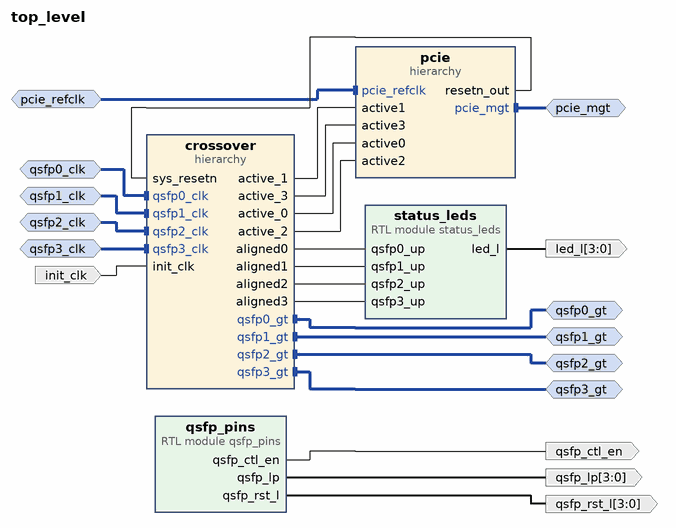
[diagram p0: block diagram of the top level]
# Vivado block design top_level, xcvu9p-flgb2104-3-e, Vivado 2021.1
create_bd_design top_level

create_bd_intf_port -mode Slave -vlnv xilinx.com:interface:diff_clock_rtl:1.0 qsfp0_clk
set_property -dict {CONFIG.FREQ_HZ 322265625} [get_bd_intf_ports qsfp0_clk]
create_bd_intf_port -mode Master -vlnv xilinx.com:interface:gt_rtl:1.0 qsfp0_gt
create_bd_intf_port -mode Master -vlnv xilinx.com:interface:gt_rtl:1.0 qsfp1_gt
create_bd_intf_port -mode Slave -vlnv xilinx.com:interface:diff_clock_rtl:1.0 qsfp1_clk
set_property -dict {CONFIG.FREQ_HZ 322265625} [get_bd_intf_ports qsfp1_clk]
create_bd_intf_port -mode Slave -vlnv xilinx.com:interface:diff_clock_rtl:1.0 pcie_refclk
create_bd_intf_port -mode Master -vlnv xilinx.com:interface:pcie_7x_mgt_rtl:1.0 pcie_mgt
create_bd_intf_port -mode Master -vlnv xilinx.com:interface:gt_rtl:1.0 qsfp2_gt
create_bd_intf_port -mode Slave -vlnv xilinx.com:interface:diff_clock_rtl:1.0 qsfp2_clk
set_property -dict {CONFIG.FREQ_HZ 322265625} [get_bd_intf_ports qsfp2_clk]
create_bd_intf_port -mode Master -vlnv xilinx.com:interface:gt_rtl:1.0 qsfp3_gt
create_bd_intf_port -mode Slave -vlnv xilinx.com:interface:diff_clock_rtl:1.0 qsfp3_clk
set_property -dict {CONFIG.FREQ_HZ 322265625} [get_bd_intf_ports qsfp3_clk]
create_bd_port -dir O -from 3 -to 0 led_l
create_bd_port -dir O -from 3 -to 0 qsfp_rst_l
create_bd_port -dir O -from 3 -to 0 qsfp_lp
create_bd_port -dir I init_clk
create_bd_port -dir O qsfp_ctl_en

create_bd_cell -type hier crossover
create_bd_cell -type hier pcie
create_bd_cell -type module -reference status_leds status_leds
create_bd_cell -type module -reference qsfp_pins qsfp_pins

# ---- hierarchy /crossover ----
current_bd_instance /crossover
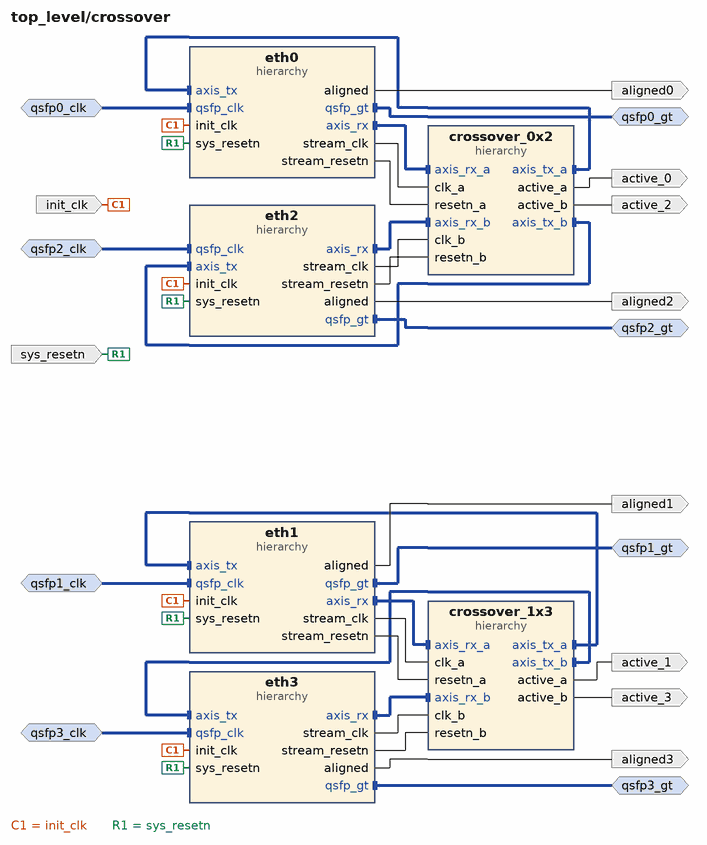
[diagram p1: block diagram inside /crossover]
create_bd_intf_pin -mode Master -vlnv xilinx.com:interface:gt_rtl:1.0 qsfp0_gt
create_bd_intf_pin -mode Slave -vlnv xilinx.com:interface:diff_clock_rtl:1.0 qsfp0_clk
create_bd_intf_pin -mode Master -vlnv xilinx.com:interface:gt_rtl:1.0 qsfp1_gt
create_bd_intf_pin -mode Slave -vlnv xilinx.com:interface:diff_clock_rtl:1.0 qsfp1_clk
create_bd_intf_pin -mode Master -vlnv xilinx.com:interface:gt_rtl:1.0 qsfp2_gt
create_bd_intf_pin -mode Slave -vlnv xilinx.com:interface:diff_clock_rtl:1.0 qsfp2_clk
create_bd_intf_pin -mode Master -vlnv xilinx.com:interface:gt_rtl:1.0 qsfp3_gt
create_bd_intf_pin -mode Slave -vlnv xilinx.com:interface:diff_clock_rtl:1.0 qsfp3_clk
create_bd_pin -dir I init_clk
create_bd_pin -dir I sys_resetn
create_bd_pin -dir O active_0
create_bd_pin -dir O aligned0
create_bd_pin -dir O aligned1
create_bd_pin -dir O active_2
create_bd_pin -dir O aligned2
create_bd_pin -dir O aligned3
create_bd_pin -dir O active_1
create_bd_pin -dir O active_3

create_bd_cell -type hier crossover_0x2
create_bd_cell -type hier eth0
create_bd_cell -type hier eth2
create_bd_cell -type hier eth1
create_bd_cell -type hier eth3
create_bd_cell -type hier crossover_1x3

# ---- hierarchy /crossover/crossover_0x2 ----
current_bd_instance /crossover/crossover_0x2
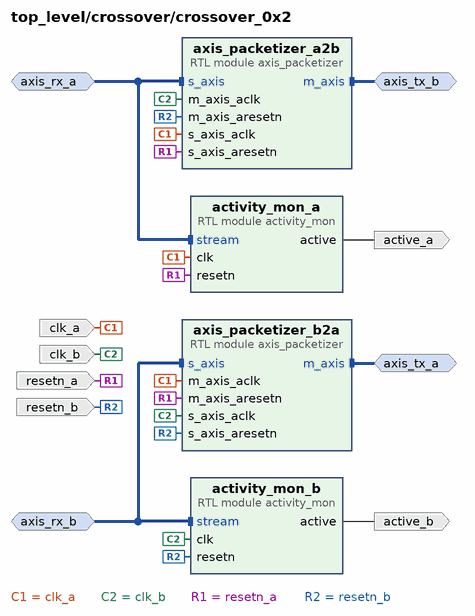
[diagram p2: block diagram inside /crossover/crossover_0x2]
create_bd_intf_pin -mode Slave -vlnv xilinx.com:interface:axis_rtl:1.0 axis_rx_a
create_bd_intf_pin -mode Master -vlnv xilinx.com:interface:axis_rtl:1.0 axis_tx_b
create_bd_intf_pin -mode Master -vlnv xilinx.com:interface:axis_rtl:1.0 axis_tx_a
create_bd_intf_pin -mode Slave -vlnv xilinx.com:interface:axis_rtl:1.0 axis_rx_b
create_bd_pin -dir I clk_a
create_bd_pin -dir I resetn_a
create_bd_pin -dir I clk_b
create_bd_pin -dir I resetn_b
create_bd_pin -dir O active_a
create_bd_pin -dir O active_b

create_bd_cell -type module -reference activity_mon activity_mon_a
create_bd_cell -type module -reference activity_mon activity_mon_b
create_bd_cell -type module -reference axis_packetizer axis_packetizer_a2b
create_bd_cell -type module -reference axis_packetizer axis_packetizer_b2a

# ---- hierarchy /crossover/eth0 ----
current_bd_instance /crossover/eth0
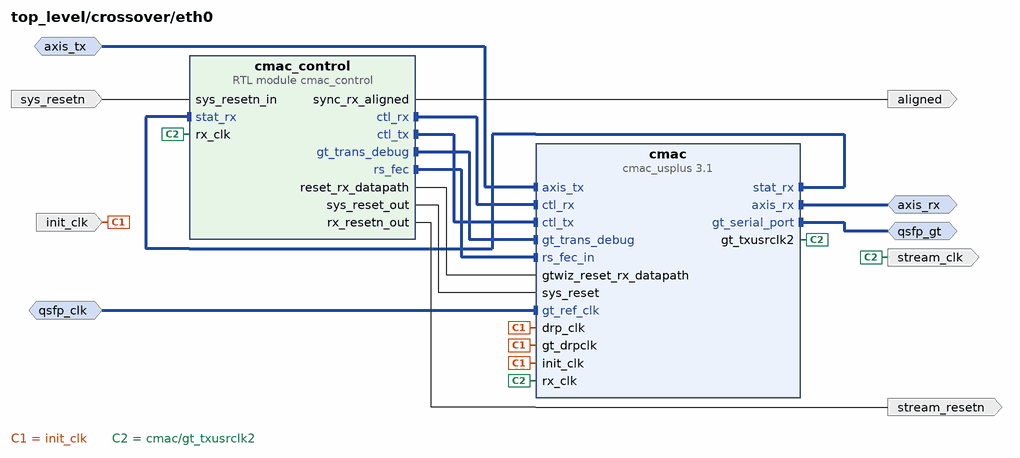
[diagram p3: block diagram inside /crossover/eth0]
create_bd_intf_pin -mode Master -vlnv xilinx.com:interface:gt_rtl:1.0 qsfp_gt
create_bd_intf_pin -mode Slave -vlnv xilinx.com:interface:diff_clock_rtl:1.0 qsfp_clk
create_bd_intf_pin -mode Slave -vlnv xilinx.com:interface:axis_rtl:1.0 axis_tx
create_bd_intf_pin -mode Master -vlnv xilinx.com:interface:axis_rtl:1.0 axis_rx
create_bd_pin -dir I -type rst sys_resetn
create_bd_pin -dir O -type clk stream_clk
create_bd_pin -dir O -type rst stream_resetn
create_bd_pin -dir O aligned
create_bd_pin -dir I init_clk

create_bd_cell -type ip -vlnv xilinx.com:ip:cmac_usplus:3.1 cmac
set_property -dict [list \
  CONFIG.ADD_GT_CNRL_STS_PORTS 1 \
  CONFIG.CMAC_CAUI4_MODE 1 \
  CONFIG.CMAC_CORE_SELECT CMACE4_X0Y1 \
  CONFIG.GT_DRP_CLK 50 \
  CONFIG.GT_GROUP_SELECT {X0Y4~X0Y7} \
  CONFIG.GT_REF_CLK_FREQ 322.265625 \
  CONFIG.INCLUDE_RS_FEC 1 \
  CONFIG.NUM_LANES 4x25 \
  CONFIG.RX_FLOW_CONTROL 0 \
  CONFIG.RX_GT_BUFFER 1 \
  CONFIG.TX_FLOW_CONTROL 0 \
  CONFIG.USER_INTERFACE AXIS \
] [get_bd_cells cmac]
create_bd_cell -type module -reference cmac_control cmac_control
set_property -dict {CONFIG.USE_SYS_RESET_OUT 1} [get_bd_cells cmac_control]

# ---- hierarchy /crossover/eth2 ----
current_bd_instance /crossover/eth2
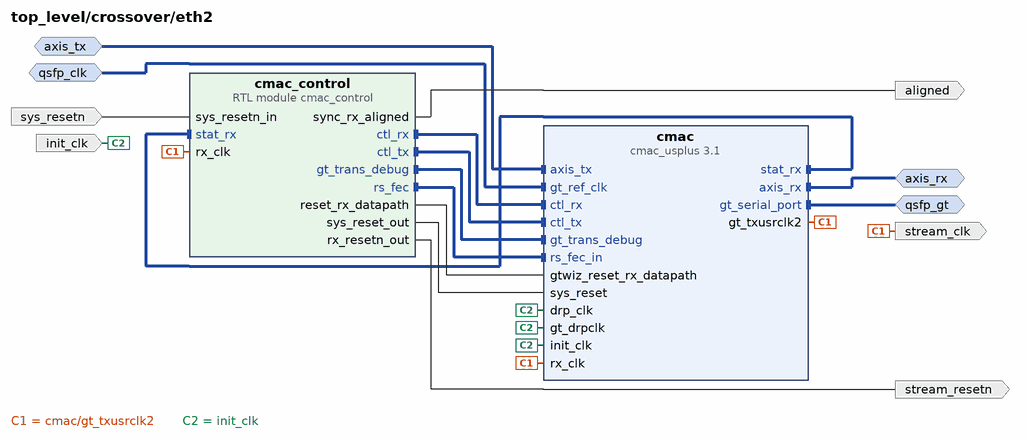
[diagram p4: block diagram inside /crossover/eth2]
create_bd_intf_pin -mode Master -vlnv xilinx.com:interface:gt_rtl:1.0 qsfp_gt
create_bd_intf_pin -mode Slave -vlnv xilinx.com:interface:axis_rtl:1.0 axis_tx
create_bd_intf_pin -mode Master -vlnv xilinx.com:interface:axis_rtl:1.0 axis_rx
create_bd_intf_pin -mode Slave -vlnv xilinx.com:interface:diff_clock_rtl:1.0 qsfp_clk
create_bd_pin -dir I -type rst sys_resetn
create_bd_pin -dir O -type clk stream_clk
create_bd_pin -dir O -type rst stream_resetn
create_bd_pin -dir O aligned
create_bd_pin -dir I init_clk

create_bd_cell -type ip -vlnv xilinx.com:ip:cmac_usplus:3.1 cmac
set_property -dict [list \
  CONFIG.ADD_GT_CNRL_STS_PORTS 1 \
  CONFIG.CMAC_CAUI4_MODE 1 \
  CONFIG.CMAC_CORE_SELECT CMACE4_X0Y4 \
  CONFIG.GT_DRP_CLK 50 \
  CONFIG.GT_GROUP_SELECT {X0Y24~X0Y27} \
  CONFIG.GT_REF_CLK_FREQ 322.265625 \
  CONFIG.INCLUDE_RS_FEC 1 \
  CONFIG.NUM_LANES 4x25 \
  CONFIG.RX_FLOW_CONTROL 0 \
  CONFIG.RX_GT_BUFFER 1 \
  CONFIG.TX_FLOW_CONTROL 0 \
  CONFIG.USER_INTERFACE AXIS \
] [get_bd_cells cmac]
create_bd_cell -type module -reference cmac_control cmac_control
set_property -dict {CONFIG.USE_SYS_RESET_OUT 1} [get_bd_cells cmac_control]

# ---- hierarchy /crossover/eth1 ----
current_bd_instance /crossover/eth1
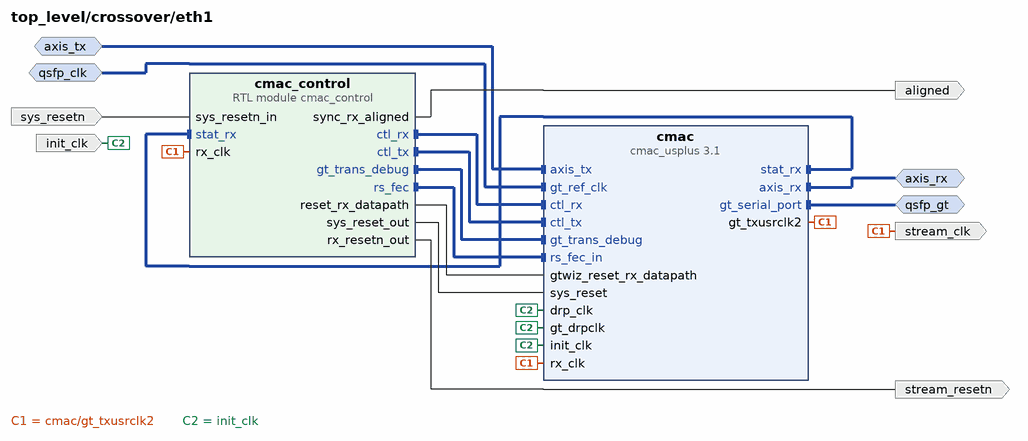
[diagram p5: block diagram inside /crossover/eth1]
create_bd_intf_pin -mode Master -vlnv xilinx.com:interface:gt_rtl:1.0 qsfp_gt
create_bd_intf_pin -mode Slave -vlnv xilinx.com:interface:axis_rtl:1.0 axis_tx
create_bd_intf_pin -mode Master -vlnv xilinx.com:interface:axis_rtl:1.0 axis_rx
create_bd_intf_pin -mode Slave -vlnv xilinx.com:interface:diff_clock_rtl:1.0 qsfp_clk
create_bd_pin -dir I -type rst sys_resetn
create_bd_pin -dir O -type clk stream_clk
create_bd_pin -dir O -type rst stream_resetn
create_bd_pin -dir O aligned
create_bd_pin -dir I init_clk

create_bd_cell -type ip -vlnv xilinx.com:ip:cmac_usplus:3.1 cmac
set_property -dict [list \
  CONFIG.ADD_GT_CNRL_STS_PORTS 1 \
  CONFIG.CMAC_CAUI4_MODE 1 \
  CONFIG.CMAC_CORE_SELECT CMACE4_X0Y2 \
  CONFIG.GT_DRP_CLK 50 \
  CONFIG.GT_GROUP_SELECT {X0Y12~X0Y15} \
  CONFIG.GT_REF_CLK_FREQ 322.265625 \
  CONFIG.INCLUDE_RS_FEC 1 \
  CONFIG.NUM_LANES 4x25 \
  CONFIG.RX_FLOW_CONTROL 0 \
  CONFIG.RX_GT_BUFFER 1 \
  CONFIG.TX_FLOW_CONTROL 0 \
  CONFIG.USER_INTERFACE AXIS \
] [get_bd_cells cmac]
create_bd_cell -type module -reference cmac_control cmac_control
set_property -dict {CONFIG.USE_SYS_RESET_OUT 1} [get_bd_cells cmac_control]

# ---- hierarchy /crossover/eth3 ----
current_bd_instance /crossover/eth3
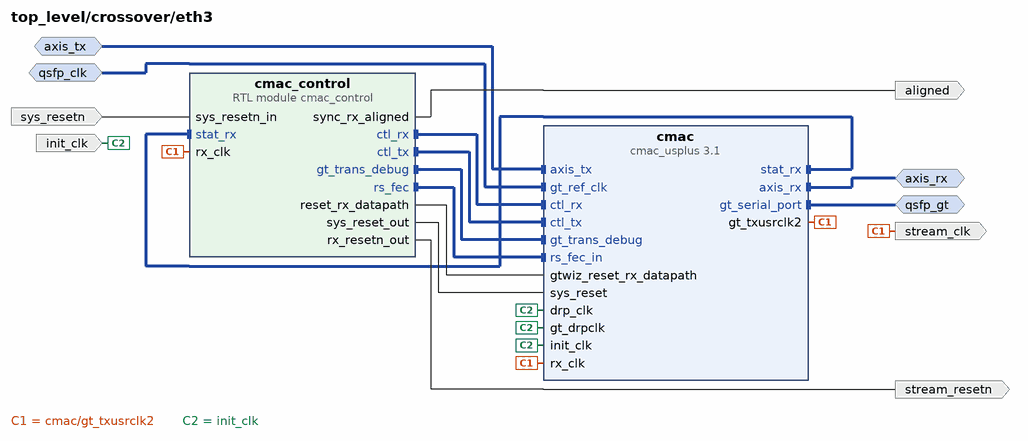
[diagram p6: block diagram inside /crossover/eth3]
create_bd_intf_pin -mode Master -vlnv xilinx.com:interface:gt_rtl:1.0 qsfp_gt
create_bd_intf_pin -mode Slave -vlnv xilinx.com:interface:axis_rtl:1.0 axis_tx
create_bd_intf_pin -mode Master -vlnv xilinx.com:interface:axis_rtl:1.0 axis_rx
create_bd_intf_pin -mode Slave -vlnv xilinx.com:interface:diff_clock_rtl:1.0 qsfp_clk
create_bd_pin -dir I -type rst sys_resetn
create_bd_pin -dir O -type clk stream_clk
create_bd_pin -dir O -type rst stream_resetn
create_bd_pin -dir O aligned
create_bd_pin -dir I init_clk

create_bd_cell -type ip -vlnv xilinx.com:ip:cmac_usplus:3.1 cmac
set_property -dict [list \
  CONFIG.ADD_GT_CNRL_STS_PORTS 1 \
  CONFIG.CMAC_CAUI4_MODE 1 \
  CONFIG.CMAC_CORE_SELECT CMACE4_X0Y5 \
  CONFIG.GT_DRP_CLK 50 \
  CONFIG.GT_GROUP_SELECT {X0Y32~X0Y35} \
  CONFIG.GT_REF_CLK_FREQ 322.265625 \
  CONFIG.INCLUDE_RS_FEC 1 \
  CONFIG.NUM_LANES 4x25 \
  CONFIG.RX_FLOW_CONTROL 0 \
  CONFIG.RX_GT_BUFFER 1 \
  CONFIG.TX_FLOW_CONTROL 0 \
  CONFIG.USER_INTERFACE AXIS \
] [get_bd_cells cmac]
create_bd_cell -type module -reference cmac_control cmac_control
set_property -dict {CONFIG.USE_SYS_RESET_OUT 1} [get_bd_cells cmac_control]

# ---- hierarchy /crossover/crossover_1x3 ----
current_bd_instance /crossover/crossover_1x3
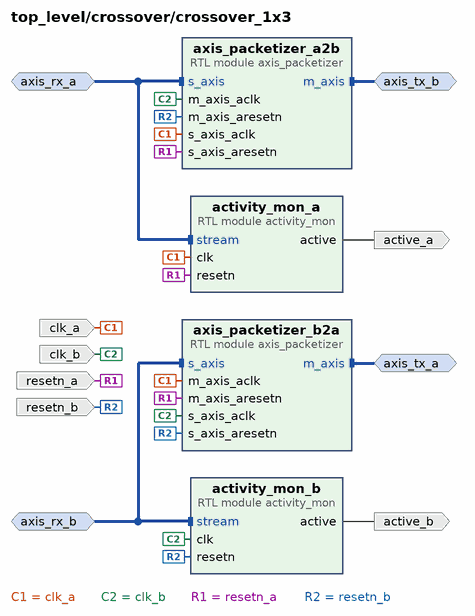
[diagram p7: block diagram inside /crossover/crossover_1x3]
create_bd_intf_pin -mode Slave -vlnv xilinx.com:interface:axis_rtl:1.0 axis_rx_a
create_bd_intf_pin -mode Master -vlnv xilinx.com:interface:axis_rtl:1.0 axis_tx_b
create_bd_intf_pin -mode Master -vlnv xilinx.com:interface:axis_rtl:1.0 axis_tx_a
create_bd_intf_pin -mode Slave -vlnv xilinx.com:interface:axis_rtl:1.0 axis_rx_b
create_bd_pin -dir I clk_a
create_bd_pin -dir I resetn_a
create_bd_pin -dir I clk_b
create_bd_pin -dir I resetn_b
create_bd_pin -dir O active_a
create_bd_pin -dir O active_b

create_bd_cell -type module -reference activity_mon activity_mon_a
create_bd_cell -type module -reference activity_mon activity_mon_b
create_bd_cell -type module -reference axis_packetizer axis_packetizer_a2b
create_bd_cell -type module -reference axis_packetizer axis_packetizer_b2a

# ---- hierarchy /pcie ----
current_bd_instance /pcie
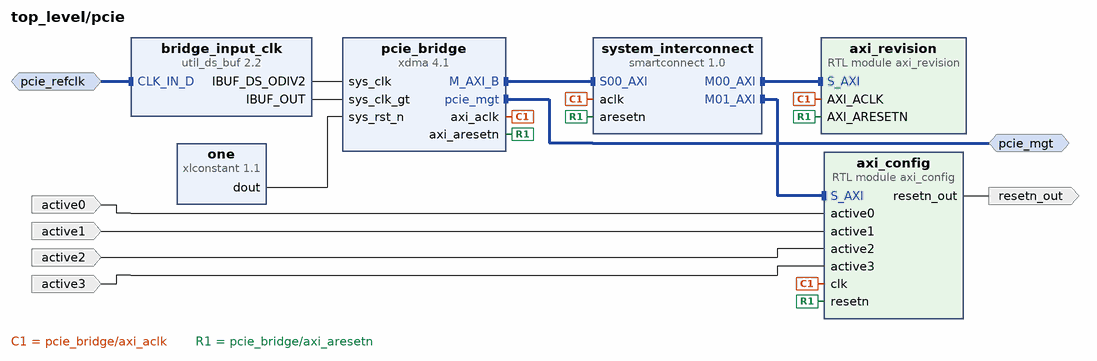
[diagram p8: block diagram inside /pcie]
create_bd_intf_pin -mode Master -vlnv xilinx.com:interface:pcie_7x_mgt_rtl:1.0 pcie_mgt
create_bd_intf_pin -mode Slave -vlnv xilinx.com:interface:diff_clock_rtl:1.0 pcie_refclk
create_bd_pin -dir O resetn_out
create_bd_pin -dir I active0
create_bd_pin -dir I active1
create_bd_pin -dir I active2
create_bd_pin -dir I active3

create_bd_cell -type module -reference axi_revision axi_revision
create_bd_cell -type ip -vlnv xilinx.com:ip:smartconnect:1.0 system_interconnect
set_property -dict {CONFIG.NUM_MI 2 CONFIG.NUM_SI 1} [get_bd_cells system_interconnect]
create_bd_cell -type ip -vlnv xilinx.com:ip:util_ds_buf:2.2 bridge_input_clk
set_property -dict {CONFIG.C_BUF_TYPE IBUFDSGTE} [get_bd_cells bridge_input_clk]
create_bd_cell -type ip -vlnv xilinx.com:ip:xdma:4.1 pcie_bridge
set_property -dict [list \
  CONFIG.PF0_DEVICE_ID_mqdma 903F \
  CONFIG.PF0_SRIOV_VF_DEVICE_ID A03F \
  CONFIG.PF2_DEVICE_ID_mqdma 923F \
  CONFIG.PF3_DEVICE_ID_mqdma 933F \
  CONFIG.axi_addr_width 64 \
  CONFIG.axi_data_width 512_bit \
  CONFIG.axisten_freq 250 \
  CONFIG.bridge_burst true \
  CONFIG.en_axi_master_if true \
  CONFIG.en_axi_slave_if false \
  CONFIG.functional_mode AXI_Bridge \
  CONFIG.mode_selection Advanced \
  CONFIG.pcie_blk_locn X1Y2 \
  CONFIG.pf0_bar0_scale Megabytes \
  CONFIG.pf0_bar0_size 1 \
  CONFIG.pf0_bar1_enabled true \
  CONFIG.pf0_bar1_scale Megabytes \
  CONFIG.pf0_bar1_size 1 \
  CONFIG.pf0_device_id 903F \
  CONFIG.pl_link_cap_max_link_speed 8.0_GT/s \
  CONFIG.pl_link_cap_max_link_width X16 \
  CONFIG.plltype QPLL1 \
] [get_bd_cells pcie_bridge]
create_bd_cell -type ip -vlnv xilinx.com:ip:xlconstant:1.1 one
create_bd_cell -type module -reference axi_config axi_config

# ---- connections ----

current_bd_instance /crossover
connect_bd_intf_net [get_bd_intf_pins crossover_0x2/axis_rx_a] [get_bd_intf_pins eth0/axis_rx]
connect_bd_intf_net [get_bd_intf_pins crossover_0x2/axis_rx_b] [get_bd_intf_pins eth2/axis_rx]
connect_bd_intf_net [get_bd_intf_pins eth1/axis_tx] [get_bd_intf_pins crossover_1x3/axis_tx_a]
connect_bd_intf_net [get_bd_intf_pins eth3/axis_tx] [get_bd_intf_pins crossover_1x3/axis_tx_b]
connect_bd_intf_net [get_bd_intf_pins crossover_0x2/axis_tx_a] [get_bd_intf_pins eth0/axis_tx]
connect_bd_intf_net [get_bd_intf_pins crossover_0x2/axis_tx_b] [get_bd_intf_pins eth2/axis_tx]
connect_bd_intf_net [get_bd_intf_pins eth1/axis_rx] [get_bd_intf_pins crossover_1x3/axis_rx_a]
connect_bd_intf_net [get_bd_intf_pins eth3/axis_rx] [get_bd_intf_pins crossover_1x3/axis_rx_b]
connect_bd_intf_net [get_bd_intf_pins qsfp0_gt] [get_bd_intf_pins eth0/qsfp_gt]
connect_bd_intf_net [get_bd_intf_pins qsfp2_gt] [get_bd_intf_pins eth2/qsfp_gt]
connect_bd_intf_net [get_bd_intf_pins qsfp1_gt] [get_bd_intf_pins eth1/qsfp_gt]
connect_bd_intf_net [get_bd_intf_pins qsfp3_gt] [get_bd_intf_pins eth3/qsfp_gt]
connect_bd_intf_net [get_bd_intf_pins qsfp0_clk] [get_bd_intf_pins eth0/qsfp_clk]
connect_bd_intf_net [get_bd_intf_pins qsfp1_clk] [get_bd_intf_pins eth1/qsfp_clk]
connect_bd_intf_net [get_bd_intf_pins qsfp2_clk] [get_bd_intf_pins eth2/qsfp_clk]
connect_bd_intf_net [get_bd_intf_pins qsfp3_clk] [get_bd_intf_pins eth3/qsfp_clk]
connect_bd_net -net clk_a_1 [get_bd_pins eth0/stream_clk] [get_bd_pins crossover_0x2/clk_a]
connect_bd_net -net clk_b_1 [get_bd_pins eth2/stream_clk] [get_bd_pins crossover_0x2/clk_b]
connect_bd_net [get_bd_pins crossover_0x2/active_a] [get_bd_pins active_0]
connect_bd_net [get_bd_pins crossover_0x2/active_b] [get_bd_pins active_2]
connect_bd_net [get_bd_pins crossover_1x3/active_a] [get_bd_pins active_1]
connect_bd_net [get_bd_pins crossover_1x3/active_b] [get_bd_pins active_3]
connect_bd_net [get_bd_pins eth1/stream_clk] [get_bd_pins crossover_1x3/clk_a]
connect_bd_net [get_bd_pins eth1/stream_resetn] [get_bd_pins crossover_1x3/resetn_a]
connect_bd_net [get_bd_pins eth3/stream_clk] [get_bd_pins crossover_1x3/clk_b]
connect_bd_net [get_bd_pins eth3/stream_resetn] [get_bd_pins crossover_1x3/resetn_b]
connect_bd_net -net eth_aligned [get_bd_pins eth0/aligned] [get_bd_pins aligned0]
connect_bd_net -net eth_aligned1 [get_bd_pins eth2/aligned] [get_bd_pins aligned2]
connect_bd_net -net eth_aligned2 [get_bd_pins eth1/aligned] [get_bd_pins aligned1]
connect_bd_net -net eth_aligned3 [get_bd_pins eth3/aligned] [get_bd_pins aligned3]
connect_bd_net -net init_clk_0_1 [get_bd_pins init_clk] \
  [get_bd_pins eth0/init_clk] [get_bd_pins eth2/init_clk] [get_bd_pins eth1/init_clk] [get_bd_pins eth3/init_clk]
connect_bd_net -net resetn_a_1 [get_bd_pins eth0/stream_resetn] [get_bd_pins crossover_0x2/resetn_a]
connect_bd_net -net resetn_b_1 [get_bd_pins eth2/stream_resetn] [get_bd_pins crossover_0x2/resetn_b]
connect_bd_net -net source_200Mhz_resetn [get_bd_pins sys_resetn] \
  [get_bd_pins eth0/sys_resetn] [get_bd_pins eth2/sys_resetn] [get_bd_pins eth1/sys_resetn] [get_bd_pins eth3/sys_resetn]

current_bd_instance /crossover/crossover_0x2
connect_bd_intf_net [get_bd_intf_pins axis_tx_b] [get_bd_intf_pins axis_packetizer_a2b/m_axis]
connect_bd_intf_net [get_bd_intf_pins axis_tx_a] [get_bd_intf_pins axis_packetizer_b2a/m_axis]
connect_bd_intf_net [get_bd_intf_pins axis_rx_a] [get_bd_intf_pins axis_packetizer_a2b/s_axis]
connect_bd_intf_net [get_bd_intf_pins axis_rx_a] [get_bd_intf_pins activity_mon_a/stream]
connect_bd_intf_net [get_bd_intf_pins axis_rx_b] [get_bd_intf_pins axis_packetizer_b2a/s_axis]
connect_bd_intf_net [get_bd_intf_pins axis_rx_b] [get_bd_intf_pins activity_mon_b/stream]
connect_bd_net [get_bd_pins activity_mon_a/active] [get_bd_pins active_a]
connect_bd_net [get_bd_pins activity_mon_b/active] [get_bd_pins active_b]
connect_bd_net [get_bd_pins clk_a] \
  [get_bd_pins activity_mon_a/clk] [get_bd_pins axis_packetizer_a2b/s_axis_aclk] \
  [get_bd_pins axis_packetizer_b2a/m_axis_aclk]
connect_bd_net [get_bd_pins clk_b] \
  [get_bd_pins activity_mon_b/clk] [get_bd_pins axis_packetizer_a2b/m_axis_aclk] \
  [get_bd_pins axis_packetizer_b2a/s_axis_aclk]
connect_bd_net [get_bd_pins resetn_a] \
  [get_bd_pins activity_mon_a/resetn] [get_bd_pins axis_packetizer_a2b/s_axis_aresetn] \
  [get_bd_pins axis_packetizer_b2a/m_axis_aresetn]
connect_bd_net [get_bd_pins resetn_b] \
  [get_bd_pins activity_mon_b/resetn] [get_bd_pins axis_packetizer_a2b/m_axis_aresetn] \
  [get_bd_pins axis_packetizer_b2a/s_axis_aresetn]

current_bd_instance /crossover/eth0
connect_bd_intf_net [get_bd_intf_pins axis_tx] [get_bd_intf_pins cmac/axis_tx]
connect_bd_intf_net [get_bd_intf_pins axis_rx] [get_bd_intf_pins cmac/axis_rx]
connect_bd_intf_net [get_bd_intf_pins cmac_control/ctl_rx] [get_bd_intf_pins cmac/ctl_rx]
connect_bd_intf_net [get_bd_intf_pins cmac_control/ctl_tx] [get_bd_intf_pins cmac/ctl_tx]
connect_bd_intf_net [get_bd_intf_pins cmac_control/gt_trans_debug] [get_bd_intf_pins cmac/gt_trans_debug]
connect_bd_intf_net [get_bd_intf_pins cmac_control/rs_fec] [get_bd_intf_pins cmac/rs_fec_in]
connect_bd_intf_net [get_bd_intf_pins cmac_control/stat_rx] [get_bd_intf_pins cmac/stat_rx]
connect_bd_intf_net [get_bd_intf_pins qsfp_gt] [get_bd_intf_pins cmac/gt_serial_port]
connect_bd_intf_net [get_bd_intf_pins qsfp_clk] [get_bd_intf_pins cmac/gt_ref_clk]
connect_bd_net -net clk_0_1 [get_bd_pins init_clk] [get_bd_pins cmac/gt_drpclk] [get_bd_pins cmac/init_clk] [get_bd_pins cmac/drp_clk]
connect_bd_net -net cmac_control_0_reset_rx_datapath [get_bd_pins cmac_control/reset_rx_datapath] [get_bd_pins cmac/gtwiz_reset_rx_datapath]
connect_bd_net -net cmac_control_0_rx_resetn_out [get_bd_pins cmac_control/rx_resetn_out] [get_bd_pins stream_resetn]
connect_bd_net -net cmac_control_0_sync_rx_aligned [get_bd_pins cmac_control/sync_rx_aligned] [get_bd_pins aligned]
connect_bd_net [get_bd_pins cmac_control/sys_reset_out] [get_bd_pins cmac/sys_reset]
connect_bd_net -net cmac_gt_rxusrclk2 [get_bd_pins cmac/gt_txusrclk2] \
  [get_bd_pins stream_clk] [get_bd_pins cmac/rx_clk] [get_bd_pins cmac_control/rx_clk]
connect_bd_net [get_bd_pins sys_resetn] [get_bd_pins cmac_control/sys_resetn_in]

current_bd_instance /crossover/eth2
connect_bd_intf_net [get_bd_intf_pins axis_tx] [get_bd_intf_pins cmac/axis_tx]
connect_bd_intf_net [get_bd_intf_pins qsfp_clk] [get_bd_intf_pins cmac/gt_ref_clk]
connect_bd_intf_net [get_bd_intf_pins axis_rx] [get_bd_intf_pins cmac/axis_rx]
connect_bd_intf_net [get_bd_intf_pins cmac_control/ctl_rx] [get_bd_intf_pins cmac/ctl_rx]
connect_bd_intf_net [get_bd_intf_pins cmac_control/ctl_tx] [get_bd_intf_pins cmac/ctl_tx]
connect_bd_intf_net [get_bd_intf_pins cmac_control/gt_trans_debug] [get_bd_intf_pins cmac/gt_trans_debug]
connect_bd_intf_net [get_bd_intf_pins cmac_control/rs_fec] [get_bd_intf_pins cmac/rs_fec_in]
connect_bd_intf_net [get_bd_intf_pins cmac_control/stat_rx] [get_bd_intf_pins cmac/stat_rx]
connect_bd_intf_net [get_bd_intf_pins qsfp_gt] [get_bd_intf_pins cmac/gt_serial_port]
connect_bd_net -net cmac_control_0_reset_rx_datapath [get_bd_pins cmac_control/reset_rx_datapath] [get_bd_pins cmac/gtwiz_reset_rx_datapath]
connect_bd_net -net cmac_control_0_rx_resetn_out [get_bd_pins cmac_control/rx_resetn_out] [get_bd_pins stream_resetn]
connect_bd_net -net cmac_control_0_sync_rx_aligned [get_bd_pins cmac_control/sync_rx_aligned] [get_bd_pins aligned]
connect_bd_net [get_bd_pins cmac_control/sys_reset_out] [get_bd_pins cmac/sys_reset]
connect_bd_net -net cmac_gt_rxusrclk2 [get_bd_pins cmac/gt_txusrclk2] \
  [get_bd_pins stream_clk] [get_bd_pins cmac/rx_clk] [get_bd_pins cmac_control/rx_clk]
connect_bd_net -net init_clk_divider_init_clk [get_bd_pins init_clk] \
  [get_bd_pins cmac/gt_drpclk] [get_bd_pins cmac/init_clk] [get_bd_pins cmac/drp_clk]
connect_bd_net [get_bd_pins sys_resetn] [get_bd_pins cmac_control/sys_resetn_in]

current_bd_instance /crossover/eth1
connect_bd_intf_net [get_bd_intf_pins axis_tx] [get_bd_intf_pins cmac/axis_tx]
connect_bd_intf_net [get_bd_intf_pins qsfp_clk] [get_bd_intf_pins cmac/gt_ref_clk]
connect_bd_intf_net [get_bd_intf_pins axis_rx] [get_bd_intf_pins cmac/axis_rx]
connect_bd_intf_net [get_bd_intf_pins cmac_control/ctl_rx] [get_bd_intf_pins cmac/ctl_rx]
connect_bd_intf_net [get_bd_intf_pins cmac_control/ctl_tx] [get_bd_intf_pins cmac/ctl_tx]
connect_bd_intf_net [get_bd_intf_pins cmac_control/gt_trans_debug] [get_bd_intf_pins cmac/gt_trans_debug]
connect_bd_intf_net [get_bd_intf_pins cmac_control/rs_fec] [get_bd_intf_pins cmac/rs_fec_in]
connect_bd_intf_net [get_bd_intf_pins cmac_control/stat_rx] [get_bd_intf_pins cmac/stat_rx]
connect_bd_intf_net [get_bd_intf_pins qsfp_gt] [get_bd_intf_pins cmac/gt_serial_port]
connect_bd_net -net cmac_control_0_reset_rx_datapath [get_bd_pins cmac_control/reset_rx_datapath] [get_bd_pins cmac/gtwiz_reset_rx_datapath]
connect_bd_net -net cmac_control_0_rx_resetn_out [get_bd_pins cmac_control/rx_resetn_out] [get_bd_pins stream_resetn]
connect_bd_net -net cmac_control_0_sync_rx_aligned [get_bd_pins cmac_control/sync_rx_aligned] [get_bd_pins aligned]
connect_bd_net [get_bd_pins cmac_control/sys_reset_out] [get_bd_pins cmac/sys_reset]
connect_bd_net -net cmac_gt_rxusrclk2 [get_bd_pins cmac/gt_txusrclk2] \
  [get_bd_pins stream_clk] [get_bd_pins cmac/rx_clk] [get_bd_pins cmac_control/rx_clk]
connect_bd_net -net init_clk_divider_init_clk [get_bd_pins init_clk] \
  [get_bd_pins cmac/gt_drpclk] [get_bd_pins cmac/init_clk] [get_bd_pins cmac/drp_clk]
connect_bd_net [get_bd_pins sys_resetn] [get_bd_pins cmac_control/sys_resetn_in]

current_bd_instance /crossover/eth3
connect_bd_intf_net [get_bd_intf_pins axis_tx] [get_bd_intf_pins cmac/axis_tx]
connect_bd_intf_net [get_bd_intf_pins qsfp_clk] [get_bd_intf_pins cmac/gt_ref_clk]
connect_bd_intf_net [get_bd_intf_pins axis_rx] [get_bd_intf_pins cmac/axis_rx]
connect_bd_intf_net [get_bd_intf_pins cmac_control/ctl_rx] [get_bd_intf_pins cmac/ctl_rx]
connect_bd_intf_net [get_bd_intf_pins cmac_control/ctl_tx] [get_bd_intf_pins cmac/ctl_tx]
connect_bd_intf_net [get_bd_intf_pins cmac_control/gt_trans_debug] [get_bd_intf_pins cmac/gt_trans_debug]
connect_bd_intf_net [get_bd_intf_pins cmac_control/rs_fec] [get_bd_intf_pins cmac/rs_fec_in]
connect_bd_intf_net [get_bd_intf_pins cmac_control/stat_rx] [get_bd_intf_pins cmac/stat_rx]
connect_bd_intf_net [get_bd_intf_pins qsfp_gt] [get_bd_intf_pins cmac/gt_serial_port]
connect_bd_net -net cmac_control_0_reset_rx_datapath [get_bd_pins cmac_control/reset_rx_datapath] [get_bd_pins cmac/gtwiz_reset_rx_datapath]
connect_bd_net -net cmac_control_0_rx_resetn_out [get_bd_pins cmac_control/rx_resetn_out] [get_bd_pins stream_resetn]
connect_bd_net -net cmac_control_0_sync_rx_aligned [get_bd_pins cmac_control/sync_rx_aligned] [get_bd_pins aligned]
connect_bd_net [get_bd_pins cmac_control/sys_reset_out] [get_bd_pins cmac/sys_reset]
connect_bd_net -net cmac_gt_rxusrclk2 [get_bd_pins cmac/gt_txusrclk2] \
  [get_bd_pins stream_clk] [get_bd_pins cmac/rx_clk] [get_bd_pins cmac_control/rx_clk]
connect_bd_net -net init_clk_divider_init_clk [get_bd_pins init_clk] \
  [get_bd_pins cmac/gt_drpclk] [get_bd_pins cmac/init_clk] [get_bd_pins cmac/drp_clk]
connect_bd_net [get_bd_pins sys_resetn] [get_bd_pins cmac_control/sys_resetn_in]

current_bd_instance /crossover/crossover_1x3
connect_bd_intf_net [get_bd_intf_pins axis_tx_b] [get_bd_intf_pins axis_packetizer_a2b/m_axis]
connect_bd_intf_net [get_bd_intf_pins axis_tx_a] [get_bd_intf_pins axis_packetizer_b2a/m_axis]
connect_bd_intf_net [get_bd_intf_pins axis_rx_a] [get_bd_intf_pins axis_packetizer_a2b/s_axis]
connect_bd_intf_net [get_bd_intf_pins axis_rx_a] [get_bd_intf_pins activity_mon_a/stream]
connect_bd_intf_net [get_bd_intf_pins axis_rx_b] [get_bd_intf_pins axis_packetizer_b2a/s_axis]
connect_bd_intf_net [get_bd_intf_pins axis_rx_b] [get_bd_intf_pins activity_mon_b/stream]
connect_bd_net [get_bd_pins activity_mon_a/active] [get_bd_pins active_a]
connect_bd_net [get_bd_pins activity_mon_b/active] [get_bd_pins active_b]
connect_bd_net [get_bd_pins clk_a] \
  [get_bd_pins activity_mon_a/clk] [get_bd_pins axis_packetizer_a2b/s_axis_aclk] \
  [get_bd_pins axis_packetizer_b2a/m_axis_aclk]
connect_bd_net [get_bd_pins clk_b] \
  [get_bd_pins activity_mon_b/clk] [get_bd_pins axis_packetizer_a2b/m_axis_aclk] \
  [get_bd_pins axis_packetizer_b2a/s_axis_aclk]
connect_bd_net [get_bd_pins resetn_a] \
  [get_bd_pins activity_mon_a/resetn] [get_bd_pins axis_packetizer_a2b/s_axis_aresetn] \
  [get_bd_pins axis_packetizer_b2a/m_axis_aresetn]
connect_bd_net [get_bd_pins resetn_b] \
  [get_bd_pins activity_mon_b/resetn] [get_bd_pins axis_packetizer_a2b/m_axis_aresetn] \
  [get_bd_pins axis_packetizer_b2a/s_axis_aresetn]

current_bd_instance /pcie
connect_bd_intf_net [get_bd_intf_pins pcie_refclk] [get_bd_intf_pins bridge_input_clk/CLK_IN_D]
connect_bd_intf_net [get_bd_intf_pins pcie_bridge/M_AXI_B] [get_bd_intf_pins system_interconnect/S00_AXI]
connect_bd_intf_net [get_bd_intf_pins pcie_mgt] [get_bd_intf_pins pcie_bridge/pcie_mgt]
connect_bd_intf_net [get_bd_intf_pins axi_revision/S_AXI] [get_bd_intf_pins system_interconnect/M00_AXI]
connect_bd_intf_net [get_bd_intf_pins system_interconnect/M01_AXI] [get_bd_intf_pins axi_config/S_AXI]
connect_bd_net -net active0_1 [get_bd_pins active0] [get_bd_pins axi_config/active0]
connect_bd_net -net active1_1 [get_bd_pins active1] [get_bd_pins axi_config/active1]
connect_bd_net -net active2_1 [get_bd_pins active2] [get_bd_pins axi_config/active2]
connect_bd_net -net active3_1 [get_bd_pins active3] [get_bd_pins axi_config/active3]
connect_bd_net [get_bd_pins axi_config/resetn_out] [get_bd_pins resetn_out]
connect_bd_net [get_bd_pins one/dout] [get_bd_pins pcie_bridge/sys_rst_n]
connect_bd_net [get_bd_pins pcie_bridge/axi_aclk] \
  [get_bd_pins axi_revision/AXI_ACLK] [get_bd_pins system_interconnect/aclk] [get_bd_pins axi_config/clk]
connect_bd_net [get_bd_pins pcie_bridge/axi_aresetn] \
  [get_bd_pins axi_revision/AXI_ARESETN] [get_bd_pins system_interconnect/aresetn] [get_bd_pins axi_config/resetn]
connect_bd_net -net util_ds_buf_0_IBUF_DS_ODIV2 [get_bd_pins bridge_input_clk/IBUF_DS_ODIV2] [get_bd_pins pcie_bridge/sys_clk]
connect_bd_net -net util_ds_buf_0_IBUF_OUT [get_bd_pins bridge_input_clk/IBUF_OUT] [get_bd_pins pcie_bridge/sys_clk_gt]

current_bd_instance /
connect_bd_intf_net [get_bd_intf_ports pcie_refclk] [get_bd_intf_pins pcie/pcie_refclk]
connect_bd_intf_net [get_bd_intf_ports qsfp0_gt] [get_bd_intf_pins crossover/qsfp0_gt]
connect_bd_intf_net [get_bd_intf_ports qsfp1_gt] [get_bd_intf_pins crossover/qsfp1_gt]
connect_bd_intf_net [get_bd_intf_ports qsfp0_clk] [get_bd_intf_pins crossover/qsfp0_clk]
connect_bd_intf_net [get_bd_intf_ports qsfp1_clk] [get_bd_intf_pins crossover/qsfp1_clk]
connect_bd_intf_net [get_bd_intf_ports qsfp2_gt] [get_bd_intf_pins crossover/qsfp2_gt]
connect_bd_intf_net [get_bd_intf_ports qsfp3_gt] [get_bd_intf_pins crossover/qsfp3_gt]
connect_bd_intf_net [get_bd_intf_ports pcie_mgt] [get_bd_intf_pins pcie/pcie_mgt]
connect_bd_intf_net [get_bd_intf_ports qsfp2_clk] [get_bd_intf_pins crossover/qsfp2_clk]
connect_bd_intf_net [get_bd_intf_ports qsfp3_clk] [get_bd_intf_pins crossover/qsfp3_clk]
connect_bd_net -net active1_1 [get_bd_pins crossover/active_1] [get_bd_pins pcie/active1]
connect_bd_net -net active3_1 [get_bd_pins crossover/active_3] [get_bd_pins pcie/active3]
connect_bd_net -net init_clk_0_1 [get_bd_ports init_clk] [get_bd_pins crossover/init_clk]
connect_bd_net -net loopback_active_0 [get_bd_pins crossover/active_0] [get_bd_pins pcie/active0]
connect_bd_net -net loopback_active_2 [get_bd_pins crossover/active_2] [get_bd_pins pcie/active2]
connect_bd_net -net loopback_aligned [get_bd_pins crossover/aligned0] [get_bd_pins status_leds/qsfp0_up]
connect_bd_net -net loopback_aligned1 [get_bd_pins crossover/aligned1] [get_bd_pins status_leds/qsfp1_up]
connect_bd_net -net loopback_aligned2 [get_bd_pins crossover/aligned2] [get_bd_pins status_leds/qsfp2_up]
connect_bd_net -net loopback_aligned3 [get_bd_pins crossover/aligned3] [get_bd_pins status_leds/qsfp3_up]
connect_bd_net [get_bd_pins pcie/resetn_out] [get_bd_pins crossover/sys_resetn]
connect_bd_net [get_bd_pins qsfp_pins/qsfp_ctl_en] [get_bd_ports qsfp_ctl_en]
connect_bd_net [get_bd_pins qsfp_pins/qsfp_lp] [get_bd_ports qsfp_lp]
connect_bd_net [get_bd_pins qsfp_pins/qsfp_rst_l] [get_bd_ports qsfp_rst_l]
connect_bd_net -net status_leds_led_green_l [get_bd_pins status_leds/led_l] [get_bd_ports led_l]

# ---- address map ----
assign_bd_address -offset 0x0000000000000000 -range 128 -target_address_space [get_bd_addr_spaces pcie/pcie_bridge/M_AXI_B] [get_bd_addr_segs pcie/axi_revision/S_AXI/reg0]
assign_bd_address -offset 0x0000000000001000 -range 128 -target_address_space [get_bd_addr_spaces pcie/pcie_bridge/M_AXI_B] [get_bd_addr_segs pcie/axi_config/S_AXI/reg0]

validate_bd_design
save_bd_design
